# Altium schematic sheet Tp_integrador-Perifericos.SchDoc
size A; SheetNumber: 2; SheetTotal: 3
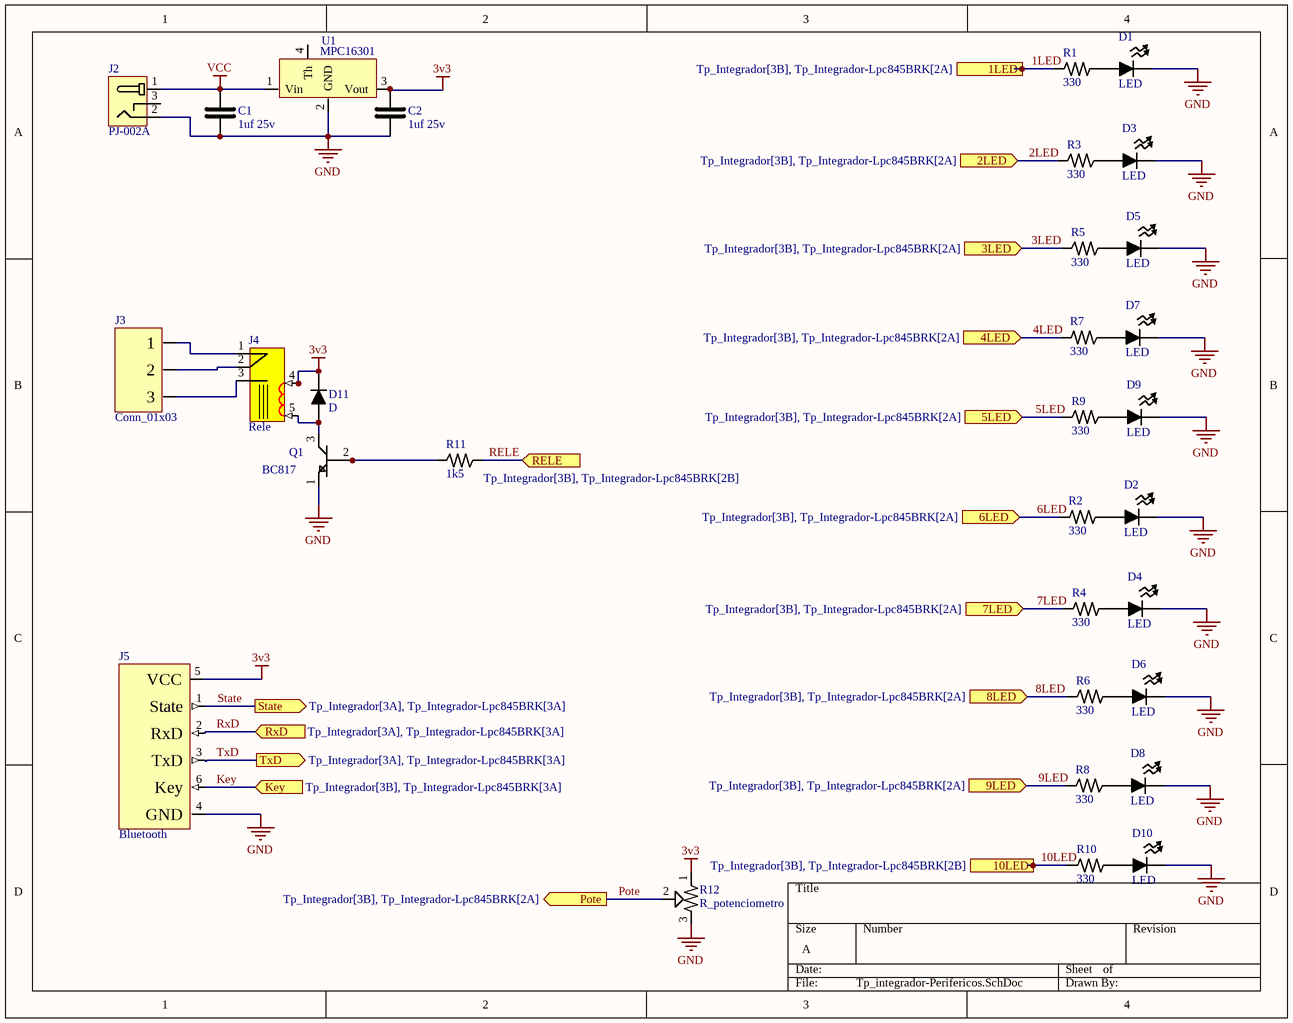
[diagram p0: Tp_integrador-Perifericos.SchDoc]

## Parts
C1  1uf 25v  [C_0805]
C2  1uf 25v  [C_0805]
D1  LED  [LED 5MM]
D2  LED  [LED 5MM]
D3  LED  [LED 5MM]
D4  LED  [LED 5MM]
D5  LED  [LED 5MM]
D6  LED  [LED 5MM]
D7  LED  [LED 5MM]
D8  LED  [LED 5MM]
D9  LED  [LED 5MM]
D10  LED  [LED 5MM]
D11  D  [Diode]
J2  PJ-002A  [Jack]
J3  Conn_01x03  [Bornier]
J4  Rele  [rele]
J5  Bluetooth  [Hc-05]
Q1  BC817  [Transistor]
R1  330  [R_0805]
R2  330  [R_0805]
R3  330  [R_0805]
R4  330  [R_0805]
R5  330  [R_0805]
R6  330  [R_0805]
R7  330  [R_0805]
R8  330  [R_0805]
R9  330  [R_0805]
R10  330  [R_0805]
R11  1k5  [R_0805]
R12  R_potenciometro  [POTE_9.5MM_PTV09-horizontal]
U1  MPC16301  [Regulador]

## Ports
1LED (in, see Tp_Integrador[3B], Tp_Integrador-Lpc845BRK[2A]), 2LED (in, see Tp_Integrador[3B], Tp_Integrador-Lpc845BRK[2A]), 3LED (in, see Tp_Integrador[3B], Tp_Integrador-Lpc845BRK[2A]), 4LED (in, see Tp_Integrador[3B], Tp_Integrador-Lpc845BRK[2A]), 5LED (in, see Tp_Integrador[3B], Tp_Integrador-Lpc845BRK[2A]), 6LED (in, see Tp_Integrador[3B], Tp_Integrador-Lpc845BRK[2A]), 7LED (in, see Tp_Integrador[3B], Tp_Integrador-Lpc845BRK[2A]), 8LED (in, see Tp_Integrador[3B], Tp_Integrador-Lpc845BRK[2A]), 9LED (in, see Tp_Integrador[3B], Tp_Integrador-Lpc845BRK[2A]), 10LED (in, see Tp_Integrador[3B], Tp_Integrador-Lpc845BRK[2B]), Key (in, see Tp_Integrador[3B], Tp_Integrador-Lpc845BRK[3A]), Pote (out, see Tp_Integrador[3B], Tp_Integrador-Lpc845BRK[2A]), RELE (in, see Tp_Integrador[3B], Tp_Integrador-Lpc845BRK[2B]), RxD (in, see Tp_Integrador[3A], Tp_Integrador-Lpc845BRK[3A]), State (out, see Tp_Integrador[3A], Tp_Integrador-Lpc845BRK[3A]), TxD (out, see Tp_Integrador[3A], Tp_Integrador-Lpc845BRK[3A])

## Nets
3v3: C2.1 D11.2(K) J4.4 J5.5(VCC) R12.1 U1.3(Vout)
GND: C1.2 C2.2 D1.2(K) D2.2(K) D3.2(K) D4.2(K) D5.2(K) D6.2(K) D7.2(K) D8.2(K) D9.2(K) D10.2(K) J2.2 J5.4(GND) Q1.1 R12.3 U1.2(GND)
VCC: C1.1 J2.1 U1.1(Vin)
1LED: R1.2 ; port 1LED
2LED: R3.2 ; port 2LED
3LED: R5.2 ; port 3LED
4LED: R7.2 ; port 4LED
5LED: R9.2 ; port 5LED
6LED: R2.2 ; port 6LED
7LED: R4.2 ; port 7LED
8LED: R6.2 ; port 8LED
9LED: R8.2 ; port 9LED
10LED: R10.2 ; port 10LED
Key: J5.6(Key) ; port Key
Pote: R12.2 ; port Pote
RELE: R11.1 ; port RELE
RxD: J5.2(RxD) ; port RxD
State: J5.1(State) ; port State
TxD: J5.3(TxD) ; port TxD
NetD1_1: D1.1(A) R1.1
NetD2_1: D2.1(A) R2.1
NetD3_1: D3.1(A) R3.1
NetD4_1: D4.1(A) R4.1
NetD5_1: D5.1(A) R5.1
NetD6_1: D6.1(A) R6.1
NetD7_1: D7.1(A) R7.1
NetD8_1: D8.1(A) R8.1
NetD9_1: D9.1(A) R9.1
NetD10_1: D10.1(A) R10.1
NetD11_1: D11.1(A) J4.5 Q1.3
NetJ3_1: J3.1 J4.1
NetJ3_2: J3.2 J4.2
NetJ3_3: J3.3 J4.3
NetQ1_2: Q1.2 R11.2

Not connected (* = marked no-connect by the designer): J2 3; U1 4(Th)

## Library data of the parts
C1 C2 = Capacitor Non Polarized_1: Capacitor NP
D11 = D: DIODO
J3 = Conn_01x03: Header 3x1
J5 = Bluetooth: Header 6x1
Q1 = Transistor NPN
R1-R11 = Resistor
U1 = MPC16301: Regulador Lineal